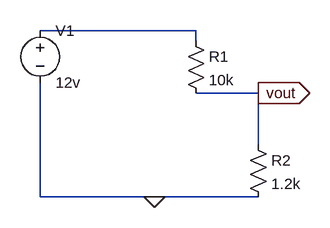
[diagram p0: schematic Draft3.asc]
Draft3.asc, the LTspice schematic file:
Version 4
SHEET 1 880 680
WIRE 272 48 32 48
WIRE 272 64 272 48
WIRE 368 144 272 144
WIRE 368 224 368 144
WIRE 32 304 32 128
WIRE 208 304 32 304
WIRE 368 304 208 304
FLAG 208 304 0
FLAG 368 144 vout
IOPIN 368 144 Out
SYMBOL res 256 48 R0
SYMATTR InstName R1
SYMATTR Value 10k
SYMBOL res 352 208 R0
SYMATTR InstName R2
SYMATTR Value 1.2k
SYMBOL voltage 32 32 R0
WINDOW 123 0 0 Left 0
WINDOW 39 0 0 Left 0
SYMATTR InstName V1
SYMATTR Value 12v

The netlist it stands for:
* Draft3.asc
R1 N001 vout 10k
R2 vout 0 1.2k
V1 N001 0 12v
.backanno
.end